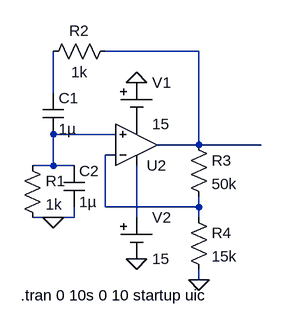
[diagram p0: schematic Draft2.asc]
Draft2.asc, the LTspice schematic file:
Version 4
SHEET 1 880 680
WIRE 288 -64 144 -64
WIRE 64 0 64 -64
WIRE 64 64 64 48
WIRE 160 64 64 64
WIRE 288 80 288 -64
WIRE 288 80 224 80
WIRE 384 80 288 80
WIRE 160 96 144 96
WIRE 64 112 64 64
WIRE 64 112 32 112
WIRE 96 112 64 112
WIRE 144 176 144 96
WIRE 288 176 288 160
WIRE 288 176 144 176
WIRE 64 192 32 192
WIRE 96 192 96 176
WIRE 96 192 64 192
WIRE 192 192 192 112
WIRE 288 192 288 176
WIRE 288 288 288 272
FLAG 64 192 0
FLAG 288 288 0
FLAG 192 256 0
FLAG 192 -16 0
SYMBOL OpAmps\\UniversalOpAmp2 192 80 M180
SYMATTR InstName U2
SYMBOL cap 48 0 R0
SYMATTR InstName C1
SYMATTR Value 1µ
SYMBOL cap 80 112 R0
SYMATTR InstName C2
SYMATTR Value 1µ
SYMBOL res 16 96 R0
SYMATTR InstName R1
SYMATTR Value 1k
SYMBOL res 160 -80 R90
WINDOW 0 0 56 VBottom 2
WINDOW 3 32 56 VTop 2
SYMATTR InstName R2
SYMATTR Value 1k
SYMBOL res 272 64 R0
SYMATTR InstName R3
SYMATTR Value 50k
SYMBOL res 272 176 R0
SYMATTR InstName R4
SYMATTR Value 15k
SYMBOL Misc\\cell 192 -16 R0
WINDOW 123 0 0 Left 0
WINDOW 39 0 0 Left 0
SYMATTR InstName V1
SYMATTR Value 15
SYMBOL Misc\\cell 192 192 R0
WINDOW 123 0 0 Left 0
WINDOW 39 0 0 Left 0
SYMATTR InstName V2
SYMATTR Value 15
TEXT 14 312 Left 2 !.tran 0 10s 0 10 startup uic

The netlist it stands for:
* Draft2.asc
XU2 N003 N004 N005 P001 N001 level2 Avol=1Meg GBW=10Meg Slew=10Meg Ilimit=25m Rail=0 Vos=0 En=0 Enk=0 In=0 Ink=0 Rin=500Meg  ; pins In+ In- V+ V- OUT
C1 N002 N003 1µ
C2 N003 0 1µ
R1 N003 0 1k
R2 N001 N002 1k
R3 N001 N004 50k
R4 N004 0 15k
V1 0 P001 15
V2 N005 0 15
.tran 0 10s 0 10 startup uic
.lib UniversalOpAmp2.lib
.backanno
.end